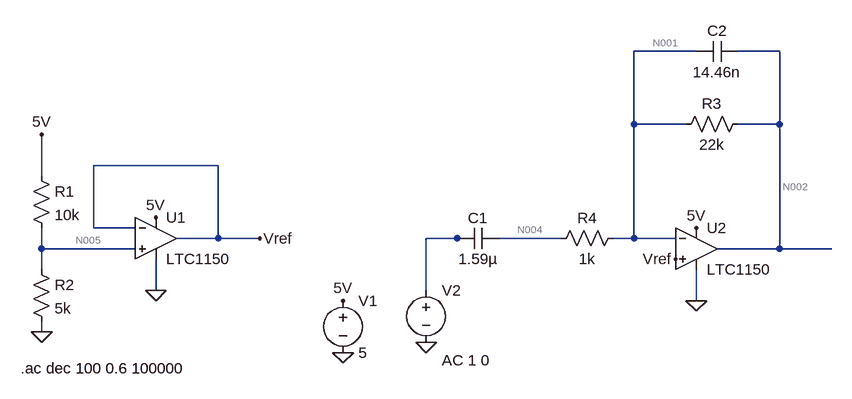
[diagram p0: schematic EMG_schematic.asc]
EMG_schematic.asc, the LTspice schematic file:
Version 4
SHEET 1 932 680
WIRE 720 -48 624 -48
WIRE 848 -48 784 -48
WIRE 624 64 624 -48
WIRE 704 64 624 64
WIRE 848 64 848 -48
WIRE 848 64 784 64
WIRE -16 128 -208 128
WIRE -288 144 -288 80
WIRE -208 224 -208 128
WIRE -144 224 -208 224
WIRE -16 240 -16 128
WIRE -16 240 -80 240
WIRE 48 240 -16 240
WIRE 352 240 304 240
WIRE 368 240 352 240
WIRE 512 240 416 240
WIRE 624 240 624 64
WIRE 624 240 592 240
WIRE 688 240 624 240
WIRE -288 256 -288 224
WIRE -144 256 -288 256
WIRE 848 256 848 64
WIRE 848 256 752 256
WIRE 928 256 848 256
WIRE -288 288 -288 256
WIRE -112 320 -112 272
WIRE 304 320 304 240
WIRE 720 336 720 288
WIRE -288 384 -288 368
FLAG -112 320 0
FLAG 176 416 0
FLAG 176 336 5V
FLAG -112 208 5V
FLAG -288 80 5V
FLAG -288 384 0
FLAG 48 240 Vref
FLAG 720 224 5V
FLAG 720 336 0
FLAG 688 272 Vref
FLAG 304 400 0
SYMBOL OpAmps\\LTC1150 -112 176 R0
SYMATTR InstName U1
SYMBOL res -304 128 R0
SYMATTR InstName R1
SYMATTR Value 10k
SYMBOL res -304 272 R0
SYMATTR InstName R2
SYMATTR Value 5k
SYMBOL voltage 176 320 R0
WINDOW 123 0 0 Left 0
WINDOW 39 0 0 Left 0
SYMATTR InstName V1
SYMATTR Value 5
SYMBOL OpAmps\\LTC1150 720 192 R0
SYMATTR InstName U2
SYMBOL cap 416 224 R90
WINDOW 0 0 32 VBottom 2
WINDOW 3 32 32 VTop 2
SYMATTR InstName C1
SYMATTR Value 1.59µ
SYMBOL cap 784 -64 R90
WINDOW 0 0 32 VBottom 2
WINDOW 3 32 32 VTop 2
SYMATTR InstName C2
SYMATTR Value 14.46n
SYMBOL res 800 48 R90
WINDOW 0 0 56 VBottom 2
WINDOW 3 32 56 VTop 2
SYMATTR InstName R3
SYMATTR Value 22k
SYMBOL res 608 224 R90
WINDOW 0 0 56 VBottom 2
WINDOW 3 32 56 VTop 2
SYMATTR InstName R4
SYMATTR Value 1k
SYMBOL voltage 304 304 R0
WINDOW 123 24 124 Left 2
WINDOW 39 0 0 Left 0
SYMATTR Value2 AC 1 0
SYMATTR InstName V2
SYMATTR Value ""
TEXT -320 440 Left 2 !.ac dec 100 0.6 100000

The netlist it stands for:
* EMG_schematic.asc
XU1 N005 Vref 5V 0 Vref LTC1150  ; pins In+ In- V+ V- OUT
R1 5V N005 10k
R2 N005 0 5k
V1 5V 0 5
XU2 Vref N001 5V 0 N002 LTC1150  ; pins In+ In- V+ V- OUT
C1 N004 N003 1.59µ
C2 N002 N001 14.46n
R3 N002 N001 22k
R4 N001 N004 1k
V2 N003 0 AC 1 0
.ac dec 100 0.6 100000
.lib LTC.lib
.backanno
.end

* Results of the author's LTspice run, read from the files saved beside the schematic
* Operating Point, zero values left out:
*   V(vref) = 1.667 V
*   V(n005) = 1.667 V
*   V(5v) = 5 V
*   V(n001) = 1.667 V
*   V(n002) = 1.667 V
*   V(n004) = 1.667 V
*   I(R2) = 333.3 µA
*   I(R1) = 333.3 µA
*   I(V1) = -1.931 mA
*   Ix(u1:3) = 798.9 µA
*   Ix(u1:4) = -798.9 µA
*   Ix(u1:5) = 1.667 pA
*   Ix(u2:3) = 798.9 µA
*   Ix(u2:4) = -798.9 µA
*   Ix(u2:5) = 1.667 pA
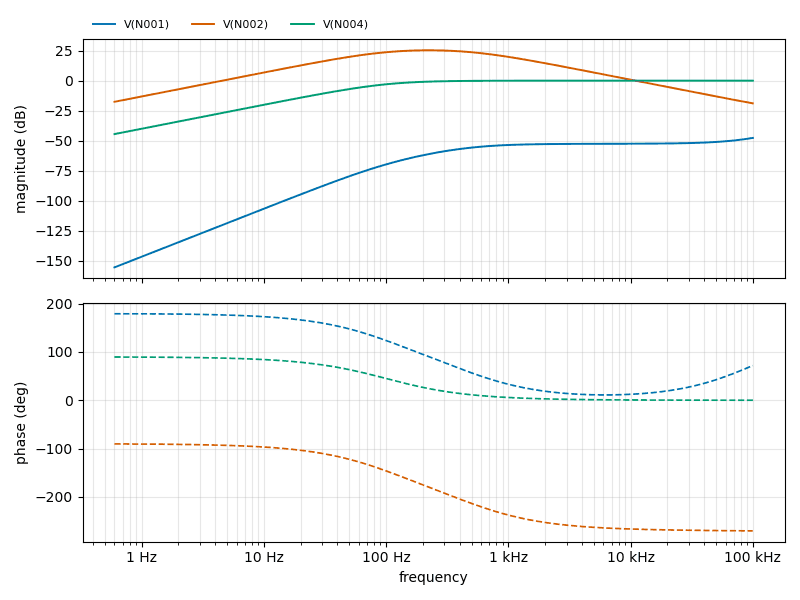
[diagram p1: AC Analysis of EMG_schematic.asc, plotted from the saved traces]
* AC Analysis, 1 run:
*   V(N001): -155.36 dB at 600 mHz, -47.64 dB at 100 kHz, peak -47.64 dB at 100 kHz, 3 dB below the peak at 56.28 kHz
*   V(N002): -17.60 dB at 600 mHz, -18.87 dB at 100 kHz, peak 25.26 dB at 222.9 Hz, 3 dB below the peak at 74.22 Hz and 673.2 Hz
*   V(N004): -44.45 dB at 600 mHz, 0.00 dB at 100 kHz, peak 0.00 dB at 100 kHz, 3 dB below the peak at 100 Hz